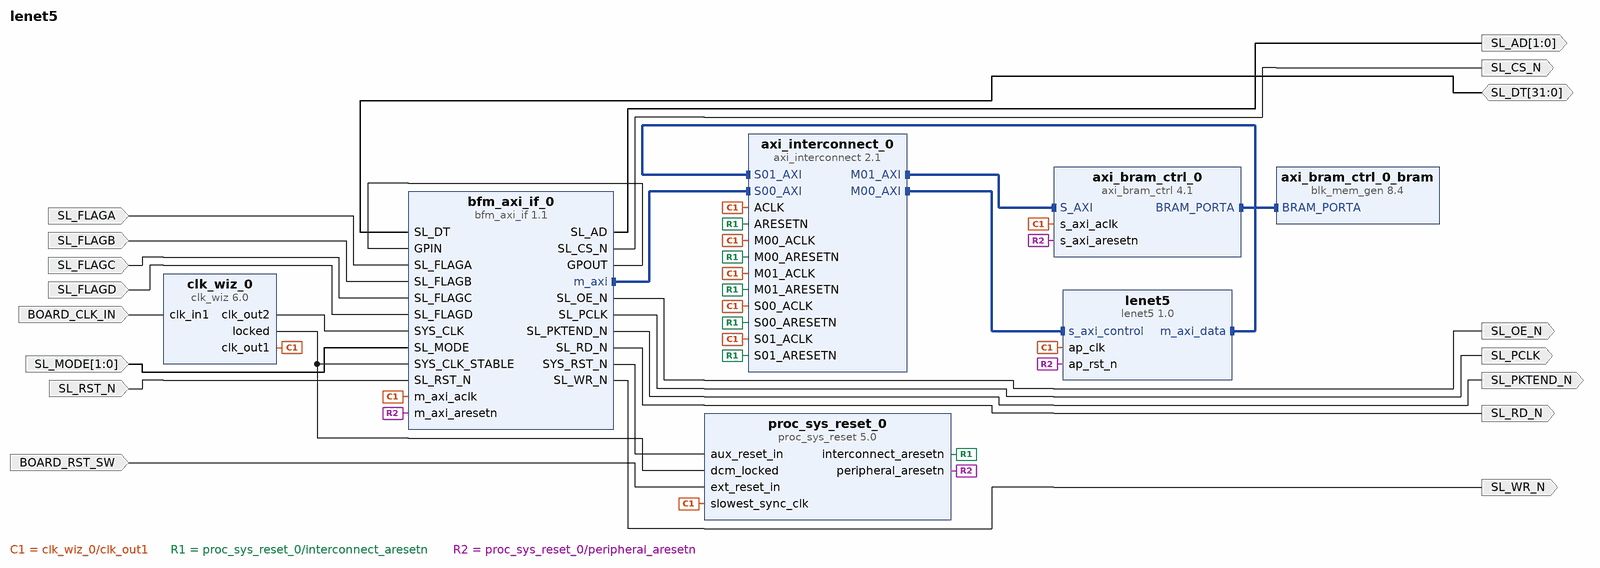
[diagram p0: block diagram of the top level]
# Vivado block design lenet5, xc7z020clg484-1, Vivado 2021.2
create_bd_design lenet5

create_bd_port -dir I -type clk BOARD_CLK_IN
create_bd_port -dir I -type rst BOARD_RST_SW
set_property -dict {CONFIG.POLARITY ACTIVE_HIGH} [get_bd_ports BOARD_RST_SW]
create_bd_port -dir O -from 1 -to 0 SL_AD
create_bd_port -dir O SL_CS_N
create_bd_port -dir IO -from 31 -to 0 SL_DT
create_bd_port -dir I SL_FLAGA
create_bd_port -dir I SL_FLAGB
create_bd_port -dir I SL_FLAGC
create_bd_port -dir I SL_FLAGD
create_bd_port -dir I -from 1 -to 0 SL_MODE
create_bd_port -dir O SL_OE_N
create_bd_port -dir O -type clk SL_PCLK
create_bd_port -dir O SL_PKTEND_N
create_bd_port -dir O SL_RD_N
create_bd_port -dir O SL_WR_N
create_bd_port -dir I -type rst SL_RST_N
set_property -dict {CONFIG.POLARITY ACTIVE_LOW} [get_bd_ports SL_RST_N]

create_bd_cell -type ip -vlnv xilinx.com:ip:axi_bram_ctrl:4.1 axi_bram_ctrl_0
set_property -dict {CONFIG.SINGLE_PORT_BRAM 1} [get_bd_cells axi_bram_ctrl_0]
create_bd_cell -type ip -vlnv xilinx.com:ip:blk_mem_gen:8.4 axi_bram_ctrl_0_bram
create_bd_cell -type ip -vlnv xilinx.com:ip:axi_interconnect:2.1 axi_interconnect_0
set_property -dict {CONFIG.NUM_MI 2 CONFIG.NUM_SI 2} [get_bd_cells axi_interconnect_0]
create_bd_cell -type ip -vlnv future-ds.com:user:bfm_axi_if:1.1 bfm_axi_if_0
create_bd_cell -type ip -vlnv xilinx.com:ip:clk_wiz:6.0 clk_wiz_0
set_property -dict [list \
  CONFIG.CLKOUT1_REQUESTED_OUT_FREQ 100 \
  CONFIG.CLKOUT2_REQUESTED_OUT_FREQ 80 \
  CONFIG.CLKOUT2_USED true \
  CONFIG.NUM_OUT_CLKS 2 \
  CONFIG.USE_LOCKED true \
  CONFIG.USE_RESET false \
] [get_bd_cells clk_wiz_0]
create_bd_cell -type ip -vlnv xilinx.com:hls:lenet5:1.0 lenet5
create_bd_cell -type ip -vlnv xilinx.com:ip:proc_sys_reset:5.0 proc_sys_reset_0

# ---- connections ----

connect_bd_intf_net [get_bd_intf_pins axi_bram_ctrl_0/BRAM_PORTA] [get_bd_intf_pins axi_bram_ctrl_0_bram/BRAM_PORTA]
connect_bd_intf_net [get_bd_intf_pins axi_interconnect_0/M00_AXI] [get_bd_intf_pins lenet5/s_axi_control]
connect_bd_intf_net [get_bd_intf_pins axi_bram_ctrl_0/S_AXI] [get_bd_intf_pins axi_interconnect_0/M01_AXI]
connect_bd_intf_net [get_bd_intf_pins axi_interconnect_0/S00_AXI] [get_bd_intf_pins bfm_axi_if_0/m_axi]
connect_bd_intf_net [get_bd_intf_pins axi_interconnect_0/S01_AXI] [get_bd_intf_pins lenet5/m_axi_data]
connect_bd_net [get_bd_ports BOARD_CLK_IN] [get_bd_pins clk_wiz_0/clk_in1]
connect_bd_net [get_bd_ports BOARD_RST_SW] [get_bd_pins proc_sys_reset_0/ext_reset_in]
connect_bd_net [get_bd_ports SL_DT] [get_bd_pins bfm_axi_if_0/SL_DT]
connect_bd_net [get_bd_ports SL_FLAGA] [get_bd_pins bfm_axi_if_0/SL_FLAGA]
connect_bd_net [get_bd_ports SL_FLAGB] [get_bd_pins bfm_axi_if_0/SL_FLAGB]
connect_bd_net [get_bd_ports SL_FLAGC] [get_bd_pins bfm_axi_if_0/SL_FLAGC]
connect_bd_net [get_bd_ports SL_FLAGD] [get_bd_pins bfm_axi_if_0/SL_FLAGD]
connect_bd_net [get_bd_ports SL_MODE] [get_bd_pins bfm_axi_if_0/SL_MODE]
connect_bd_net [get_bd_ports SL_RST_N] [get_bd_pins bfm_axi_if_0/SL_RST_N]
connect_bd_net [get_bd_pins bfm_axi_if_0/GPOUT] [get_bd_pins bfm_axi_if_0/GPIN]
connect_bd_net [get_bd_pins bfm_axi_if_0/SL_AD] [get_bd_ports SL_AD]
connect_bd_net [get_bd_pins bfm_axi_if_0/SL_CS_N] [get_bd_ports SL_CS_N]
connect_bd_net [get_bd_pins bfm_axi_if_0/SL_OE_N] [get_bd_ports SL_OE_N]
connect_bd_net [get_bd_pins bfm_axi_if_0/SL_PCLK] [get_bd_ports SL_PCLK]
connect_bd_net [get_bd_pins bfm_axi_if_0/SL_PKTEND_N] [get_bd_ports SL_PKTEND_N]
connect_bd_net [get_bd_pins bfm_axi_if_0/SL_RD_N] [get_bd_ports SL_RD_N]
connect_bd_net [get_bd_pins bfm_axi_if_0/SL_WR_N] [get_bd_ports SL_WR_N]
connect_bd_net [get_bd_pins bfm_axi_if_0/SYS_RST_N] [get_bd_pins proc_sys_reset_0/aux_reset_in]
connect_bd_net [get_bd_pins clk_wiz_0/clk_out1] \
  [get_bd_pins axi_bram_ctrl_0/s_axi_aclk] [get_bd_pins axi_interconnect_0/ACLK] [get_bd_pins axi_interconnect_0/M00_ACLK] \
  [get_bd_pins axi_interconnect_0/M01_ACLK] [get_bd_pins axi_interconnect_0/S00_ACLK] \
  [get_bd_pins axi_interconnect_0/S01_ACLK] [get_bd_pins bfm_axi_if_0/m_axi_aclk] [get_bd_pins lenet5/ap_clk] \
  [get_bd_pins proc_sys_reset_0/slowest_sync_clk]
connect_bd_net [get_bd_pins clk_wiz_0/clk_out2] [get_bd_pins bfm_axi_if_0/SYS_CLK]
connect_bd_net [get_bd_pins clk_wiz_0/locked] [get_bd_pins bfm_axi_if_0/SYS_CLK_STABLE] [get_bd_pins proc_sys_reset_0/dcm_locked]
connect_bd_net [get_bd_pins proc_sys_reset_0/interconnect_aresetn] \
  [get_bd_pins axi_interconnect_0/ARESETN] [get_bd_pins axi_interconnect_0/M00_ARESETN] \
  [get_bd_pins axi_interconnect_0/M01_ARESETN] [get_bd_pins axi_interconnect_0/S00_ARESETN] \
  [get_bd_pins axi_interconnect_0/S01_ARESETN]
connect_bd_net [get_bd_pins proc_sys_reset_0/peripheral_aresetn] \
  [get_bd_pins axi_bram_ctrl_0/s_axi_aresetn] [get_bd_pins bfm_axi_if_0/m_axi_aresetn] [get_bd_pins lenet5/ap_rst_n]

# ---- address map ----
assign_bd_address -offset 0x00000000 -range 8K -target_address_space [get_bd_addr_spaces bfm_axi_if_0/m_axi] [get_bd_addr_segs axi_bram_ctrl_0/S_AXI/Mem0]
assign_bd_address -offset 0xC0000000 -range 64K -target_address_space [get_bd_addr_spaces bfm_axi_if_0/m_axi] [get_bd_addr_segs lenet5/s_axi_control/Reg]
assign_bd_address -offset 0x00000000 -range 8K -target_address_space [get_bd_addr_spaces lenet5/Data_m_axi_data] [get_bd_addr_segs axi_bram_ctrl_0/S_AXI/Mem0]
exclude_bd_addr_seg -offset 0x00000000 -range 64K -target_address_space [get_bd_addr_spaces lenet5/Data_m_axi_data] [get_bd_addr_segs lenet5/s_axi_control/Reg]

validate_bd_design
save_bd_design
